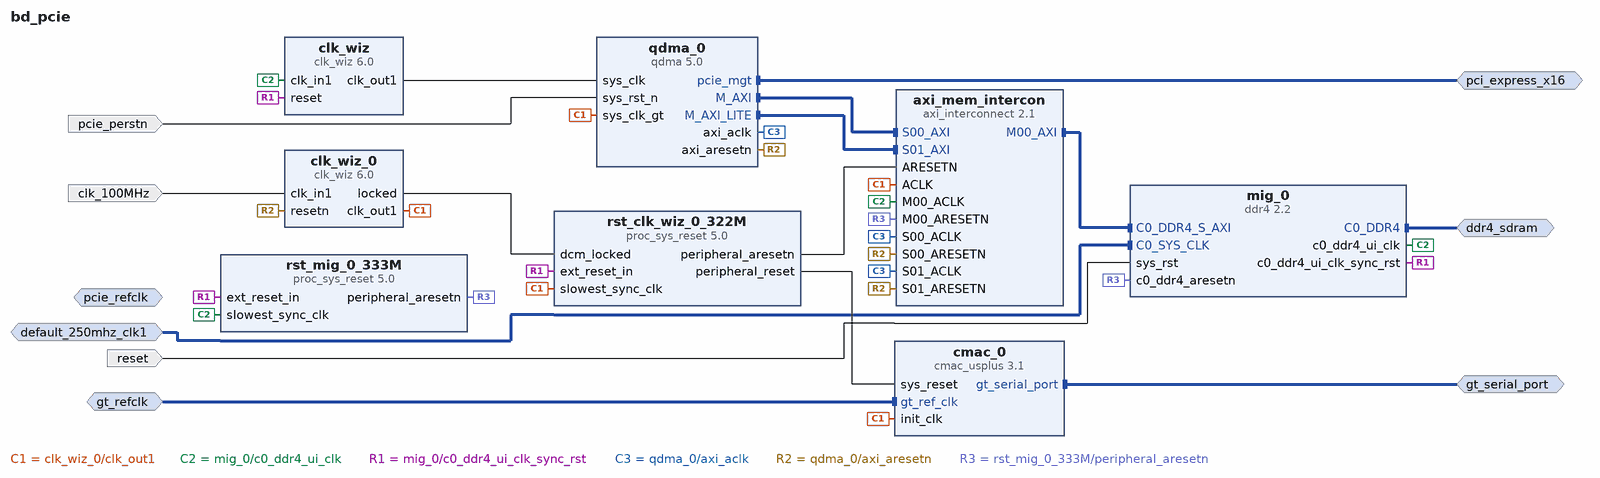
[diagram p0: block diagram of the top level]
# Vivado block design bd_pcie, xcvu9p-flga2104-2L-e, Vivado 2023.2
create_bd_design bd_pcie

create_bd_intf_port -mode Master -vlnv xilinx.com:interface:pcie_7x_mgt_rtl:1.0 pci_express_x16
create_bd_intf_port -mode Slave -vlnv xilinx.com:interface:diff_clock_rtl:1.0 pcie_refclk
set_property -dict {CONFIG.FREQ_HZ 100000000} [get_bd_intf_ports pcie_refclk]
create_bd_intf_port -mode Master -vlnv xilinx.com:interface:gt_rtl:1.0 gt_serial_port
create_bd_intf_port -mode Slave -vlnv xilinx.com:interface:diff_clock_rtl:1.0 gt_refclk
set_property -dict {CONFIG.FREQ_HZ 161132812} [get_bd_intf_ports gt_refclk]
create_bd_intf_port -mode Master -vlnv xilinx.com:interface:ddr4_rtl:1.0 ddr4_sdram
create_bd_intf_port -mode Slave -vlnv xilinx.com:interface:diff_clock_rtl:1.0 default_250mhz_clk1
set_property -dict {CONFIG.FREQ_HZ 250000000} [get_bd_intf_ports default_250mhz_clk1]
create_bd_port -dir I -type clk clk_100MHz
set_property -dict {CONFIG.FREQ_HZ 100000000} [get_bd_ports clk_100MHz]
create_bd_port -dir I -type rst reset
set_property -dict {CONFIG.POLARITY ACTIVE_HIGH} [get_bd_ports reset]
create_bd_port -dir I -type rst pcie_perstn
set_property -dict {CONFIG.POLARITY ACTIVE_LOW} [get_bd_ports pcie_perstn]

create_bd_cell -type ip -vlnv xilinx.com:ip:cmac_usplus:3.1 cmac_0
create_bd_cell -type ip -vlnv xilinx.com:ip:qdma:5.0 qdma_0
set_property -dict [list \
  CONFIG.PCIE_BOARD_INTERFACE pci_express_x16 \
  CONFIG.SYS_RST_N_BOARD_INTERFACE pcie_perstn \
  CONFIG.dma_intf_sel_qdma AXI_MM \
  CONFIG.mode_selection Advanced \
  CONFIG.pf0_bar2_enabled_qdma true \
] [get_bd_cells qdma_0]
create_bd_cell -type ip -vlnv xilinx.com:ip:ddr4:2.2 mig_0
set_property -dict {CONFIG.C0_CLOCK_BOARD_INTERFACE default_250mhz_clk1 CONFIG.RESET_BOARD_INTERFACE reset} [get_bd_cells mig_0]
create_bd_cell -type ip -vlnv xilinx.com:ip:clk_wiz:6.0 clk_wiz_0
set_property -dict [list \
  CONFIG.CLKOUT1_REQUESTED_OUT_FREQ 322.266 \
  CONFIG.CLKOUT2_REQUESTED_OUT_FREQ 100.000 \
  CONFIG.CLKOUT3_REQUESTED_OUT_FREQ 100.000 \
  CONFIG.CLKOUT4_REQUESTED_OUT_FREQ 100.000 \
  CONFIG.PRIM_IN_FREQ 300.000 \
  CONFIG.RESET_BOARD_INTERFACE Custom \
  CONFIG.RESET_TYPE ACTIVE_LOW \
  CONFIG.USE_BOARD_FLOW true \
  CONFIG.USE_RESET true \
] [get_bd_cells clk_wiz_0]
create_bd_cell -type ip -vlnv xilinx.com:ip:axi_interconnect:2.1 axi_mem_intercon
set_property -dict [list \
  CONFIG.NUM_MI 1 \
  CONFIG.NUM_SI 3 \
  CONFIG.S00_HAS_DATA_FIFO 2 \
  CONFIG.S01_HAS_DATA_FIFO 2 \
  CONFIG.S02_HAS_DATA_FIFO 2 \
] [get_bd_cells axi_mem_intercon]
create_bd_cell -type ip -vlnv xilinx.com:ip:proc_sys_reset:5.0 rst_clk_wiz_0_322M
set_property -dict {CONFIG.RESET_BOARD_INTERFACE Custom CONFIG.USE_BOARD_FLOW true} [get_bd_cells rst_clk_wiz_0_322M]
create_bd_cell -type ip -vlnv xilinx.com:ip:proc_sys_reset:5.0 rst_mig_0_333M
create_bd_cell -type ip -vlnv xilinx.com:ip:clk_wiz:6.0 clk_wiz
set_property -dict {CONFIG.RESET_BOARD_INTERFACE Custom CONFIG.USE_BOARD_FLOW true} [get_bd_cells clk_wiz]

# ---- connections ----

connect_bd_intf_net [get_bd_intf_pins axi_mem_intercon/M00_AXI] [get_bd_intf_pins mig_0/C0_DDR4_S_AXI]
connect_bd_intf_net [get_bd_intf_ports gt_serial_port] [get_bd_intf_pins cmac_0/gt_serial_port]
connect_bd_intf_net -intf_net default_250mhz_clk1_1 [get_bd_intf_ports default_250mhz_clk1] [get_bd_intf_pins mig_0/C0_SYS_CLK]
connect_bd_intf_net [get_bd_intf_ports gt_refclk] [get_bd_intf_pins cmac_0/gt_ref_clk]
connect_bd_intf_net [get_bd_intf_ports ddr4_sdram] [get_bd_intf_pins mig_0/C0_DDR4]
connect_bd_intf_net [get_bd_intf_pins qdma_0/M_AXI] [get_bd_intf_pins axi_mem_intercon/S00_AXI]
connect_bd_intf_net [get_bd_intf_pins qdma_0/M_AXI_LITE] [get_bd_intf_pins axi_mem_intercon/S01_AXI]
connect_bd_intf_net [get_bd_intf_ports pci_express_x16] [get_bd_intf_pins qdma_0/pcie_mgt]
connect_bd_net [get_bd_ports clk_100MHz] [get_bd_pins clk_wiz_0/clk_in1]
connect_bd_net [get_bd_pins clk_wiz_0/clk_out1] \
  [get_bd_pins axi_mem_intercon/ACLK] [get_bd_pins rst_clk_wiz_0_322M/slowest_sync_clk] [get_bd_pins cmac_0/init_clk] \
  [get_bd_pins qdma_0/sys_clk_gt]
connect_bd_net [get_bd_pins clk_wiz_0/locked] [get_bd_pins rst_clk_wiz_0_322M/dcm_locked]
connect_bd_net [get_bd_pins clk_wiz/clk_out1] [get_bd_pins qdma_0/sys_clk]
connect_bd_net [get_bd_pins mig_0/c0_ddr4_ui_clk] \
  [get_bd_pins axi_mem_intercon/M00_ACLK] [get_bd_pins rst_mig_0_333M/slowest_sync_clk] [get_bd_pins clk_wiz/clk_in1]
connect_bd_net [get_bd_pins mig_0/c0_ddr4_ui_clk_sync_rst] \
  [get_bd_pins rst_mig_0_333M/ext_reset_in] [get_bd_pins clk_wiz/reset] [get_bd_pins rst_clk_wiz_0_322M/ext_reset_in]
connect_bd_net [get_bd_ports pcie_perstn] [get_bd_pins qdma_0/sys_rst_n]
connect_bd_net [get_bd_pins qdma_0/axi_aclk] [get_bd_pins axi_mem_intercon/S00_ACLK] [get_bd_pins axi_mem_intercon/S01_ACLK]
connect_bd_net [get_bd_pins qdma_0/axi_aresetn] \
  [get_bd_pins clk_wiz_0/resetn] [get_bd_pins axi_mem_intercon/S00_ARESETN] [get_bd_pins axi_mem_intercon/S01_ARESETN]
connect_bd_net [get_bd_ports reset] [get_bd_pins mig_0/sys_rst]
connect_bd_net [get_bd_pins rst_clk_wiz_0_322M/peripheral_aresetn] [get_bd_pins axi_mem_intercon/ARESETN]
connect_bd_net [get_bd_pins rst_clk_wiz_0_322M/peripheral_reset] [get_bd_pins cmac_0/sys_reset]
connect_bd_net [get_bd_pins rst_mig_0_333M/peripheral_aresetn] [get_bd_pins mig_0/c0_ddr4_aresetn] [get_bd_pins axi_mem_intercon/M00_ARESETN]

# ---- address map ----
assign_bd_address -offset 0x0000000000000000 -range 2G -target_address_space [get_bd_addr_spaces qdma_0/M_AXI] [get_bd_addr_segs mig_0/C0_DDR4_MEMORY_MAP/C0_DDR4_ADDRESS_BLOCK]
assign_bd_address -offset 0x00000000 -range 2G -target_address_space [get_bd_addr_spaces qdma_0/M_AXI_LITE] [get_bd_addr_segs mig_0/C0_DDR4_MEMORY_MAP/C0_DDR4_ADDRESS_BLOCK]

validate_bd_design
save_bd_design
